# Altium project MCU_Do_An_2.PrjPcb
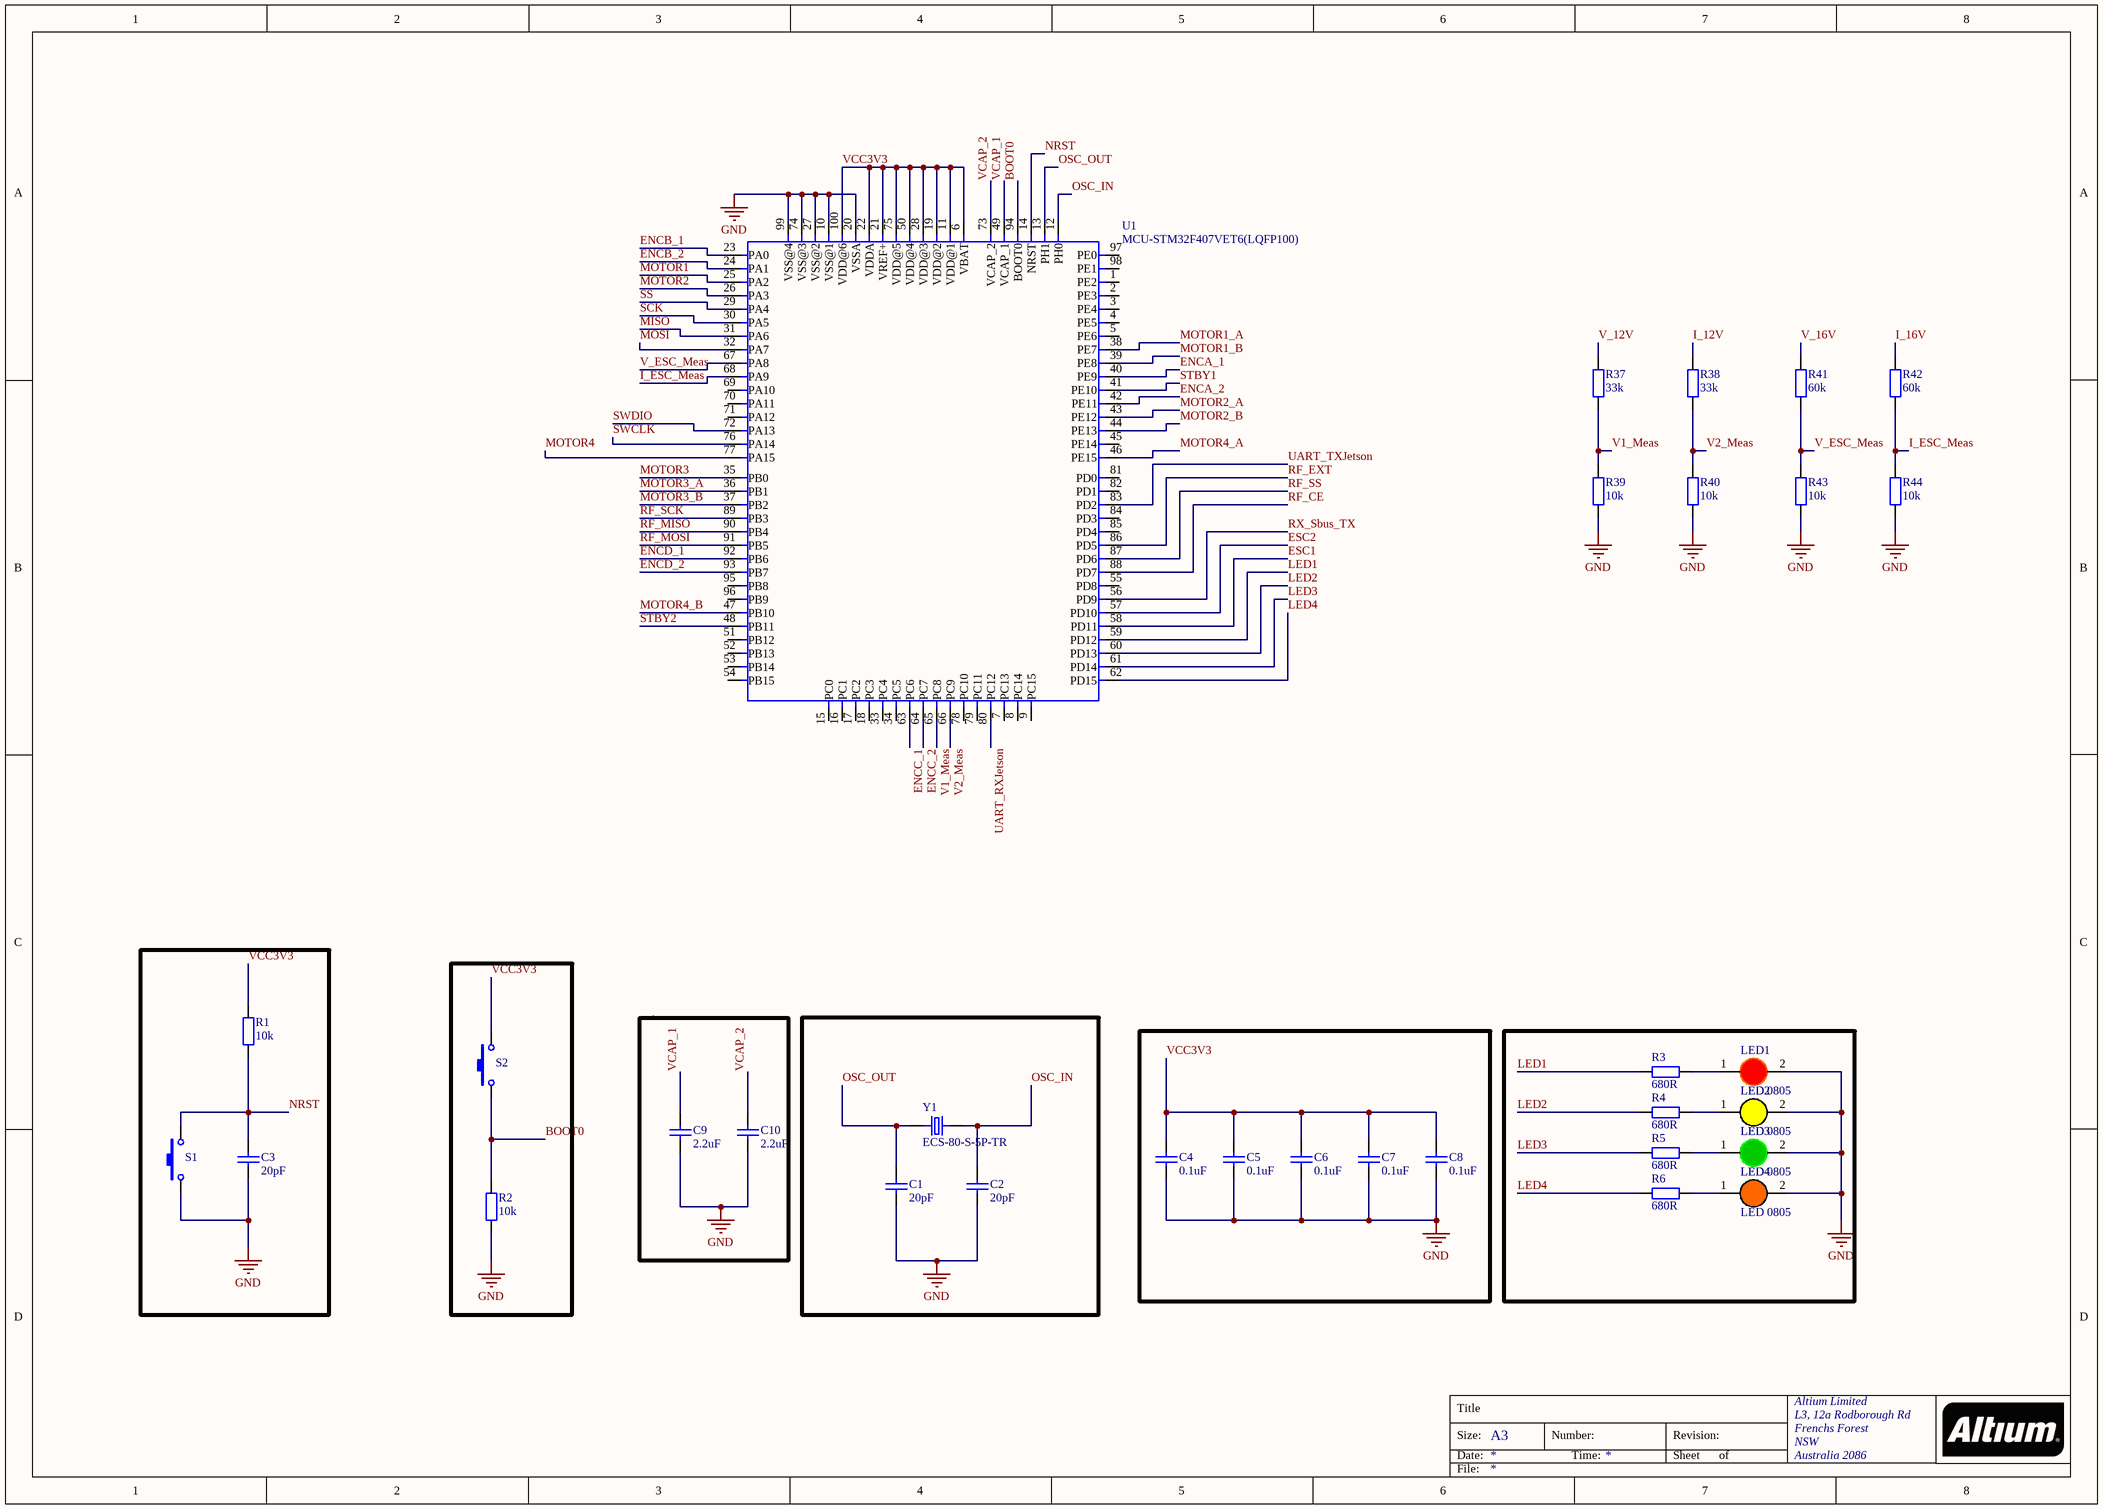
[diagram p0: MCU_Do_An_2.SchDoc]
2 sheets, 38 parts. Net scope: global (net labels, ports and power ports of the same name join across sheets).
Board files: Do_An_2_MCU.PcbDoc, Luan_Van_Version1.PcbDoc
Sheets:
  MCU_Do_An_2.SchDoc
  Power_Supply.SchDoc

## Sheet MCU_Do_An_2.SchDoc
size A3; Organization: Altium Limited; Address1: L3, 12a Rodborough Rd; Address2: Frenchs Forest; Address3: NSW; Address4: Australia 2086

### Parts
C1  20pF  [tu 0805]
C2  20pF  [tu 0805]
C3  20pF  [tu 0805]
C4  0.1uF  [tu 0805]
C5  0.1uF  [tu 0805]
C6  0.1uF  [tu 0805]
C7  0.1uF  [tu 0805]
C8  0.1uF  [tu 0805]
C9  2.2uF  [tu 0805]
C10  2.2uF  [tu 0805]
LED1  LED 0805  [LED-0805-Red]
LED2  LED 0805  [LED-0805-Yellow]
LED3  LED 0805  [LED-0805-Green]
LED4  LED 0805  [LED-0805-Orange]
R1  10k  [tro smd 0603]
R2  10k  [tro smd 0603]
R3  680R  [tro smd 0603]
R4  680R  [tro smd 0603]
R5  680R  [tro smd 0603]
R6  680R  [tro smd 0603]
R37  33k  [Tro smd 0603]
R38  33k  [Tro smd 0603]
R39  10k  [tro smd 0603]
R40  10k  [tro smd 0603]
R41  60k  [Tro smd 0603]
R42  60k  [Tro smd 0603]
R43  10k  [tro smd 0603]
R44  10k  [tro smd 0603]
S1  SW-SMD  [SW-SMD]  (value not drawn)
S2  SW-SMD  [SW-SMD]  (value not drawn)
U1  MCU-STM32F407VET6(LQFP100)  [LQFP100-0.5-13.8X13.8MM]
Y1  ECS-80-S-5P-TR  [XTAL_ECS-80-S-5P-TR]

### Nets
GND: C1.2 C2.2 C3.2 C4.2 C5.2 C6.2 C7.2 C8.2 C9.1 C10.1 LED1.2(K) LED2.2(K) LED3.2(K) LED4.2(K) R2.1 R39.1 R40.1 R43.1 R44.1 S1.1 U1.10(VSS@1) U1.20(VSSA) U1.27(VSS@2) U1.74(VSS@3) U1.99(VSS@4)
BOOT0: R2.2 S2.1 U1.94(BOOT0)
ENCA_1: U1.40(PE9)
ENCA_2: U1.42(PE11)
ENCB_1: U1.23(PA0)
ENCB_2: U1.24(PA1)
ENCC_1: U1.63(PC6)
ENCC_2: U1.64(PC7)
ENCD_1: U1.92(PB6)
ENCD_2: U1.93(PB7)
ESC1: U1.58(PD11)
ESC2: U1.57(PD10)
I_12V: R38.2
I_16V: R42.2
I_ESC_Meas: R42.1 R44.2 U1.68(PA9)
LED1: R3.1 U1.59(PD12)
LED2: R4.1 U1.60(PD13)
LED3: R5.1 U1.61(PD14)
LED4: R6.1 U1.62(PD15)
MISO: U1.31(PA6)
MOSI: U1.32(PA7)
MOTOR1: U1.25(PA2)
MOTOR1_A: U1.38(PE7)
MOTOR1_B: U1.39(PE8)
MOTOR2: U1.26(PA3)
MOTOR2_A: U1.43(PE12)
MOTOR2_B: U1.44(PE13)
MOTOR3: U1.35(PB0)
MOTOR3_A: U1.36(PB1)
MOTOR3_B: U1.37(PB2)
MOTOR4: U1.77(PA15)
MOTOR4_A: U1.46(PE15)
MOTOR4_B: U1.47(PB10)
NRST: C3.1 R1.1 S1.2 U1.14(NRST)
OSC_IN: C2.1 U1.12(PH0) Y1.2
OSC_OUT: C1.1 U1.13(PH1) Y1.1
RF_CE: U1.88(PD7)
RF_EXT: U1.86(PD5)
RF_MISO: U1.90(PB4)
RF_MOSI: U1.91(PB5)
RF_SCK: U1.89(PB3)
RF_SS: U1.87(PD6)
RX_Sbus_TX: U1.56(PD9)
SCK: U1.30(PA5)
SS: U1.29(PA4)
STBY1: U1.41(PE10)
STBY2: U1.48(PB11)
SWCLK: U1.76(PA14)
SWDIO: U1.72(PA13)
UART_RXJetson: U1.80(PC12)
UART_TXJetson: U1.83(PD2)
V1_Meas: R37.1 R39.2 U1.65(PC8)
V2_Meas: R38.1 R40.2 U1.66(PC9)
V_12V: R37.2
V_16V: R41.2
V_ESC_Meas: R41.1 R43.2 U1.67(PA8)
VCAP_1: C9.2 U1.49(VCAP_1)
VCAP_2: C10.2 U1.73(VCAP_2)
VCC3V3: C4.1 C5.1 C6.1 C7.1 C8.1 R1.2 S2.2 U1.6(VBAT) U1.11(VDD@1) U1.19(VDD@2) U1.21(VREF+) U1.22(VDDA) U1.28(VDD@3) U1.50(VDD@4) U1.75(VDD@5) U1.100(VDD@6)
NetLED1_1: LED1.1(A) R3.2
NetLED2_1: LED2.1(A) R4.2
NetLED3_1: LED3.1(A) R5.2
NetLED4_1: LED4.1(A) R6.2

Not connected (* = marked no-connect by the designer): U1 1(PE2) 2(PE3) 3(PE4) 4(PE5) 5(PE6) 7(PC13) 8(PC14) 9(PC15) 15(PC0) 16(PC1) 17(PC2) 18(PC3) 33(PC4) 34(PC5) 45(PE14) 51(PB12) 52(PB13) 53(PB14) 54(PB15) 55(PD8) 69(PA10) 70(PA11) 71(PA12) 78(PC10) 79(PC11) 81(PD0) 82(PD1) 84(PD3) 85(PD4) 95(PB8) 96(PB9) 97(PE0) 98(PE1)

### Notes on the sheet
- Title
- Size:
- Date:
- A3
- Number:
- Time:
- Revision:
- Sheet
- of
- File:

### Library data of the parts
C1-C8 = Tu 0805 20pF 50V 10%: Dán; Don_Vi: Con; Ten_Linh_Kien: Tụ 0805 20P 10% 50V; So_Chan: 2; Ma_Hang: MH004558; Chung_Loai: Dán; Kieu_Chan: *
C9 C10 = Tu 0805 225 25V 10%: Dán; Don_Vi: Con; So_Chan: 2; Ten_Linh_Kien: Tụ 0805 225-2.2uF 25V 10%; Ma_Hang: MH007483; Chung_Loai: Dán; Kieu_Chan: *
LED1 = LED 0805 Do: Dán; Don_Vi: Con; Ma_Hang: MH000897; Ten_Linh_Kien: LED 0805 Màu Đỏ (Red); Ghi_Chu: *; Kieu_Chan: *; Chung_Loai: Dán
LED2 = LED 0805 Vang: Dán; Don_Vi: Con; Ma_Hang: MH002329; Ten_Linh_Kien: LED 0805 Màu Vàng ( Yellow); Ghi_Chu: *; Kieu_Chan: *; Chung_Loai: Dán
LED3 = LED 0805 Xanh La: Dán; Don_Vi: Con; Ma_Hang: MH002326; Ten_Linh_Kien: LED 0805 Màu Xanh Lá (Green); Ghi_Chu: *; Kieu_Chan: *; Chung_Loai: Dán
LED4 = LED 0805 Cam: Dán; Don_Vi: Con; Ma_Hang: MH002328; Ten_Linh_Kien: LED 0805 Màu Cam ( Orange); Ghi_Chu: *; Kieu_Chan: *; Chung_Loai: Dán
R1 R2 R39 R40 R43 R44 = Tro 0603 1% 10k: Dán; Don_Vi: Con; So_Chan: 2; Ten_Linh_Kien: Trở 0603 1% 10k; Ma_Hang: MH006333; Chung_Loai: Dán; Kieu_Chan: *
R3-R6 = Tro 0603 1% 680R: Dán; Don_Vi: Con; So_Chan: 2; Ten_Linh_Kien: Trở 0603 1% 680R; Ma_Hang: MH006336; Chung_Loai: Dán; Kieu_Chan: *
R37 R38 R41 R42 = Tro 0603 1% 33k: Dán; Don_Vi: Con; So_Chan: 2; Ten_Linh_Kien: Trở 0603 1% 33k; Ma_Hang: MH006335; Chung_Loai: Dán; Kieu_Chan: *
S1 S2 = SW-SMD: Switch; Published: 24-Mar-1999; LatestRevisionDate: 17-Jul-2002; LatestRevisionNote: Re-released for DXP Platform.; PackageReference: SPST-2; Publisher: Altium Limited
U1 = MCU-STM32F407VET6(LQFP100): ARMÂ® CortexÂ®-M4 STM32F4 Microcontroller IC 32-Bit Single-Core 168MHz 512KB (512K x 8) FLASH 100-LQFP (14x14); MF: STMicroelectronics; Check_prices: https://www.snapeda.com/parts/STM32F407VET6/STMicroelectronics/view-part/?ref=eda; Value: *; Availability: In Stock; MP: STM32F407VET6; Price: None; Package: LQFP-100 STMicroelectronics; SnapEDA_Link: https://www.snapeda.com/parts/STM32F407VET6/STMicroelectronics/view-part/?ref=snap; Purchase-URL: https://pricing.snapeda.com/search/part/STM32F407VET6/?ref=eda
Y1 = ECS-80-S-5P-TR: CRYSTAL SMD; Package: None; Price: None; Value: *; MP: ECS-80-S-5P-TR; Availability: Unavailable

## Sheet Power_Supply.SchDoc
size A4; Organization: Altium Limited; Address1: L3, 12a Rodborough Rd; Address2: Frenchs Forest; Address3: NSW; Address4: Australia 2086
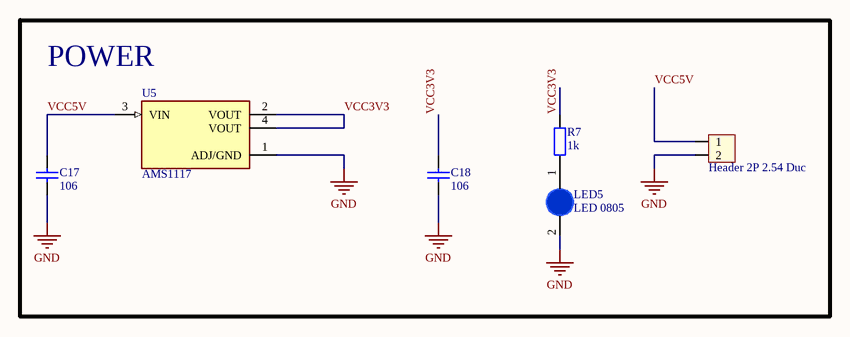
[diagram p1: Power_Supply.SchDoc]

### Parts
C17  106  [tu 0603]
C18  106  [tu 0603]
H2  Header 2P 2.54 Duc  [XH2.54M-2]
LED5  LED 0805  [LED-0805-Blue]
R7  1k  [tro smd 0603]
U5  AMS1117  [SOT229P700X180-4N]

### Blocks framed on the sheet
POWER: C17 C18 H2 LED5 R7 U5

### Nets
GND: C17.2 C18.2 H2.2 LED5.2(K) U5.1(ADJ/GND)
VCC3V3: C18.1 R7.2 U5.2(VOUT) U5.4(VOUT)
VCC5V: C17.1 H2.1 U5.3(VIN)
NetLED5_1: LED5.1(A) R7.1

### Notes on the sheet
- Title
- Size:
- Date:
- A4
- Number:
- Time:
- Revision:
- Sheet
- of
- File:

### Library data of the parts
C17 C18 = Tu 0603 106 16V 20%: Dán; Don_Vi: Con; So_Chan: 2; Ten_Linh_Kien: Tụ 0603-10uF 20% 16V; Ma_Hang: MH004848; Chung_Loai: Dán; Kieu_Chan: *
H2 = Header 2P 2.54 Duc Thang: Cắm; Ten_Linh_Kien: Header 2P XH2.54-2P Đực Thẳng; Don_Vi: Con; Ma_Hang: MH001283; Chung_Loai: Cắm
LED5 = LED 0805 Xanh Duong: Dán; Don_Vi: Con; Ma_Hang: MH002327; Ten_Linh_Kien: LED 0805 Màu Xanh Dương (Blue); Ghi_Chu: *; Kieu_Chan: *; Chung_Loai: Dán
R7 = Tro 0603 1% 1k: Dán; So_Chan: 2; Don_Vi: Con; Ten_Linh_Kien: Trở 0603 1% 1k; Ma_Hang: MH006334; Chung_Loai: Dán; Kieu_Chan: *
U5 = AMS1117: 1A LOW DROPOUT VOLTAGE REGULATOR SOT-223; MF: Advanced Monolithic Systems; Price: None; Availability: Not in stock; Package: SOT-223 Seeed Technology; MP: AMS1117; Value: *; SnapEDA_Link: https://www.snapeda.com/parts/AMS1117/Advanced+Monolithic+Systems/view-part/?ref=snap; Check_prices: https://www.snapeda.com/parts/AMS1117/Advanced+Monolithic+Systems/view-part/?ref=eda

## Nets that join several sheets
GND: MCU_Do_An_2 (25 pins), Power_Supply (5 pins)
VCC3V3: MCU_Do_An_2 (16 pins), Power_Supply (C18.1 R7.2 U5.2 U5.4)